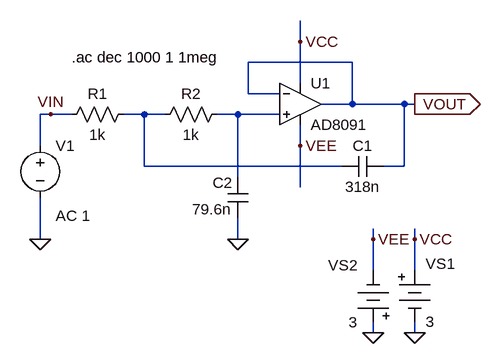
[diagram p0: schematic fig-02-07-31.asc]
fig-02-07-31.asc, the LTspice schematic file:
Version 4
SHEET 1 880 680
WIRE 192 64 192 32
WIRE 272 96 112 96
WIRE 192 128 192 64
WIRE 112 144 112 96
WIRE 160 144 112 144
WIRE 272 160 272 96
WIRE 272 160 224 160
WIRE 352 160 272 160
WIRE 368 160 352 160
WIRE -192 176 -208 176
WIRE -160 176 -192 176
WIRE -48 176 -80 176
WIRE -16 176 -48 176
WIRE 96 176 64 176
WIRE 160 176 96 176
WIRE -208 224 -208 176
WIRE 192 224 192 192
WIRE -48 256 -48 176
WIRE 256 256 -48 256
WIRE 352 256 352 160
WIRE 352 256 320 256
WIRE 96 272 96 176
WIRE 192 288 192 224
WIRE -208 368 -208 304
WIRE 96 368 96 336
WIRE 304 368 304 352
WIRE 368 368 368 352
WIRE 304 416 304 368
WIRE 368 416 368 368
WIRE 304 512 304 496
WIRE 368 512 368 496
FLAG 96 368 0
FLAG -208 368 0
FLAG 368 160 VOUT
IOPIN 368 160 Out
FLAG -192 176 VIN
FLAG 304 512 0
FLAG 368 512 0
FLAG 304 368 VEE
FLAG 368 368 VCC
FLAG 192 64 VCC
FLAG 192 224 VEE
SYMBOL Opamps\\AD8091 192 96 R0
SYMATTR InstName U1
SYMBOL cap 80 272 R0
WINDOW 0 -23 9 Left 2
WINDOW 3 -54 50 Left 2
SYMATTR InstName C2
SYMATTR Value 79.6n
SYMBOL cap 320 240 R90
WINDOW 0 0 32 VBottom 2
WINDOW 3 32 32 VTop 2
SYMATTR InstName C1
SYMATTR Value 318n
SYMBOL res 80 160 R90
WINDOW 0 0 56 VBottom 2
WINDOW 3 32 56 VTop 2
SYMATTR InstName R2
SYMATTR Value 1k
SYMBOL res -64 160 R90
WINDOW 0 0 56 VBottom 2
WINDOW 3 32 56 VTop 2
SYMATTR InstName R1
SYMATTR Value 1k
SYMBOL voltage -208 208 R0
WINDOW 123 24 124 Left 2
WINDOW 39 0 0 Left 2
SYMATTR Value2 AC 1
SYMATTR InstName V1
SYMATTR Value ""
SYMBOL Misc\\battery 368 400 R0
WINDOW 0 17 6 Left 2
WINDOW 3 17 95 Left 2
SYMATTR InstName VS1
SYMATTR Value 3
SYMBOL Misc\\battery 304 512 R180
WINDOW 0 24 104 Left 2
WINDOW 3 24 16 Left 2
SYMATTR InstName VS2
SYMATTR Value 3
TEXT -160 88 Left 2 !.ac dec 1000 1 1meg

The netlist it stands for:
* fig-02-07-31.asc
XU1 N002 VOUT VCC VEE VOUT AD8091  ; pins In+ In- V+ V- OUT
C2 N002 0 79.6n
C1 VOUT N001 318n
R2 N002 N001 1k
R1 N001 VIN 1k
V1 VIN 0 AC 1
VS1 VCC 0 3
VS2 0 VEE 3
.ac dec 1000 1 1meg
.backanno
.end